# Altium schematic sheet MODULE_MD.SchDoc: MODULE MAIN DOMAIN
size A3; Author: Silvio Navaretti; CompanyName: ARDUINO; DrawnBy: Silvio Navaretti; Engineer: Silvio Navaretti; Organization: ARDUINO; SheetNumber: 3; SheetTotal: 51; RevAuthor: Silvio Navaretti
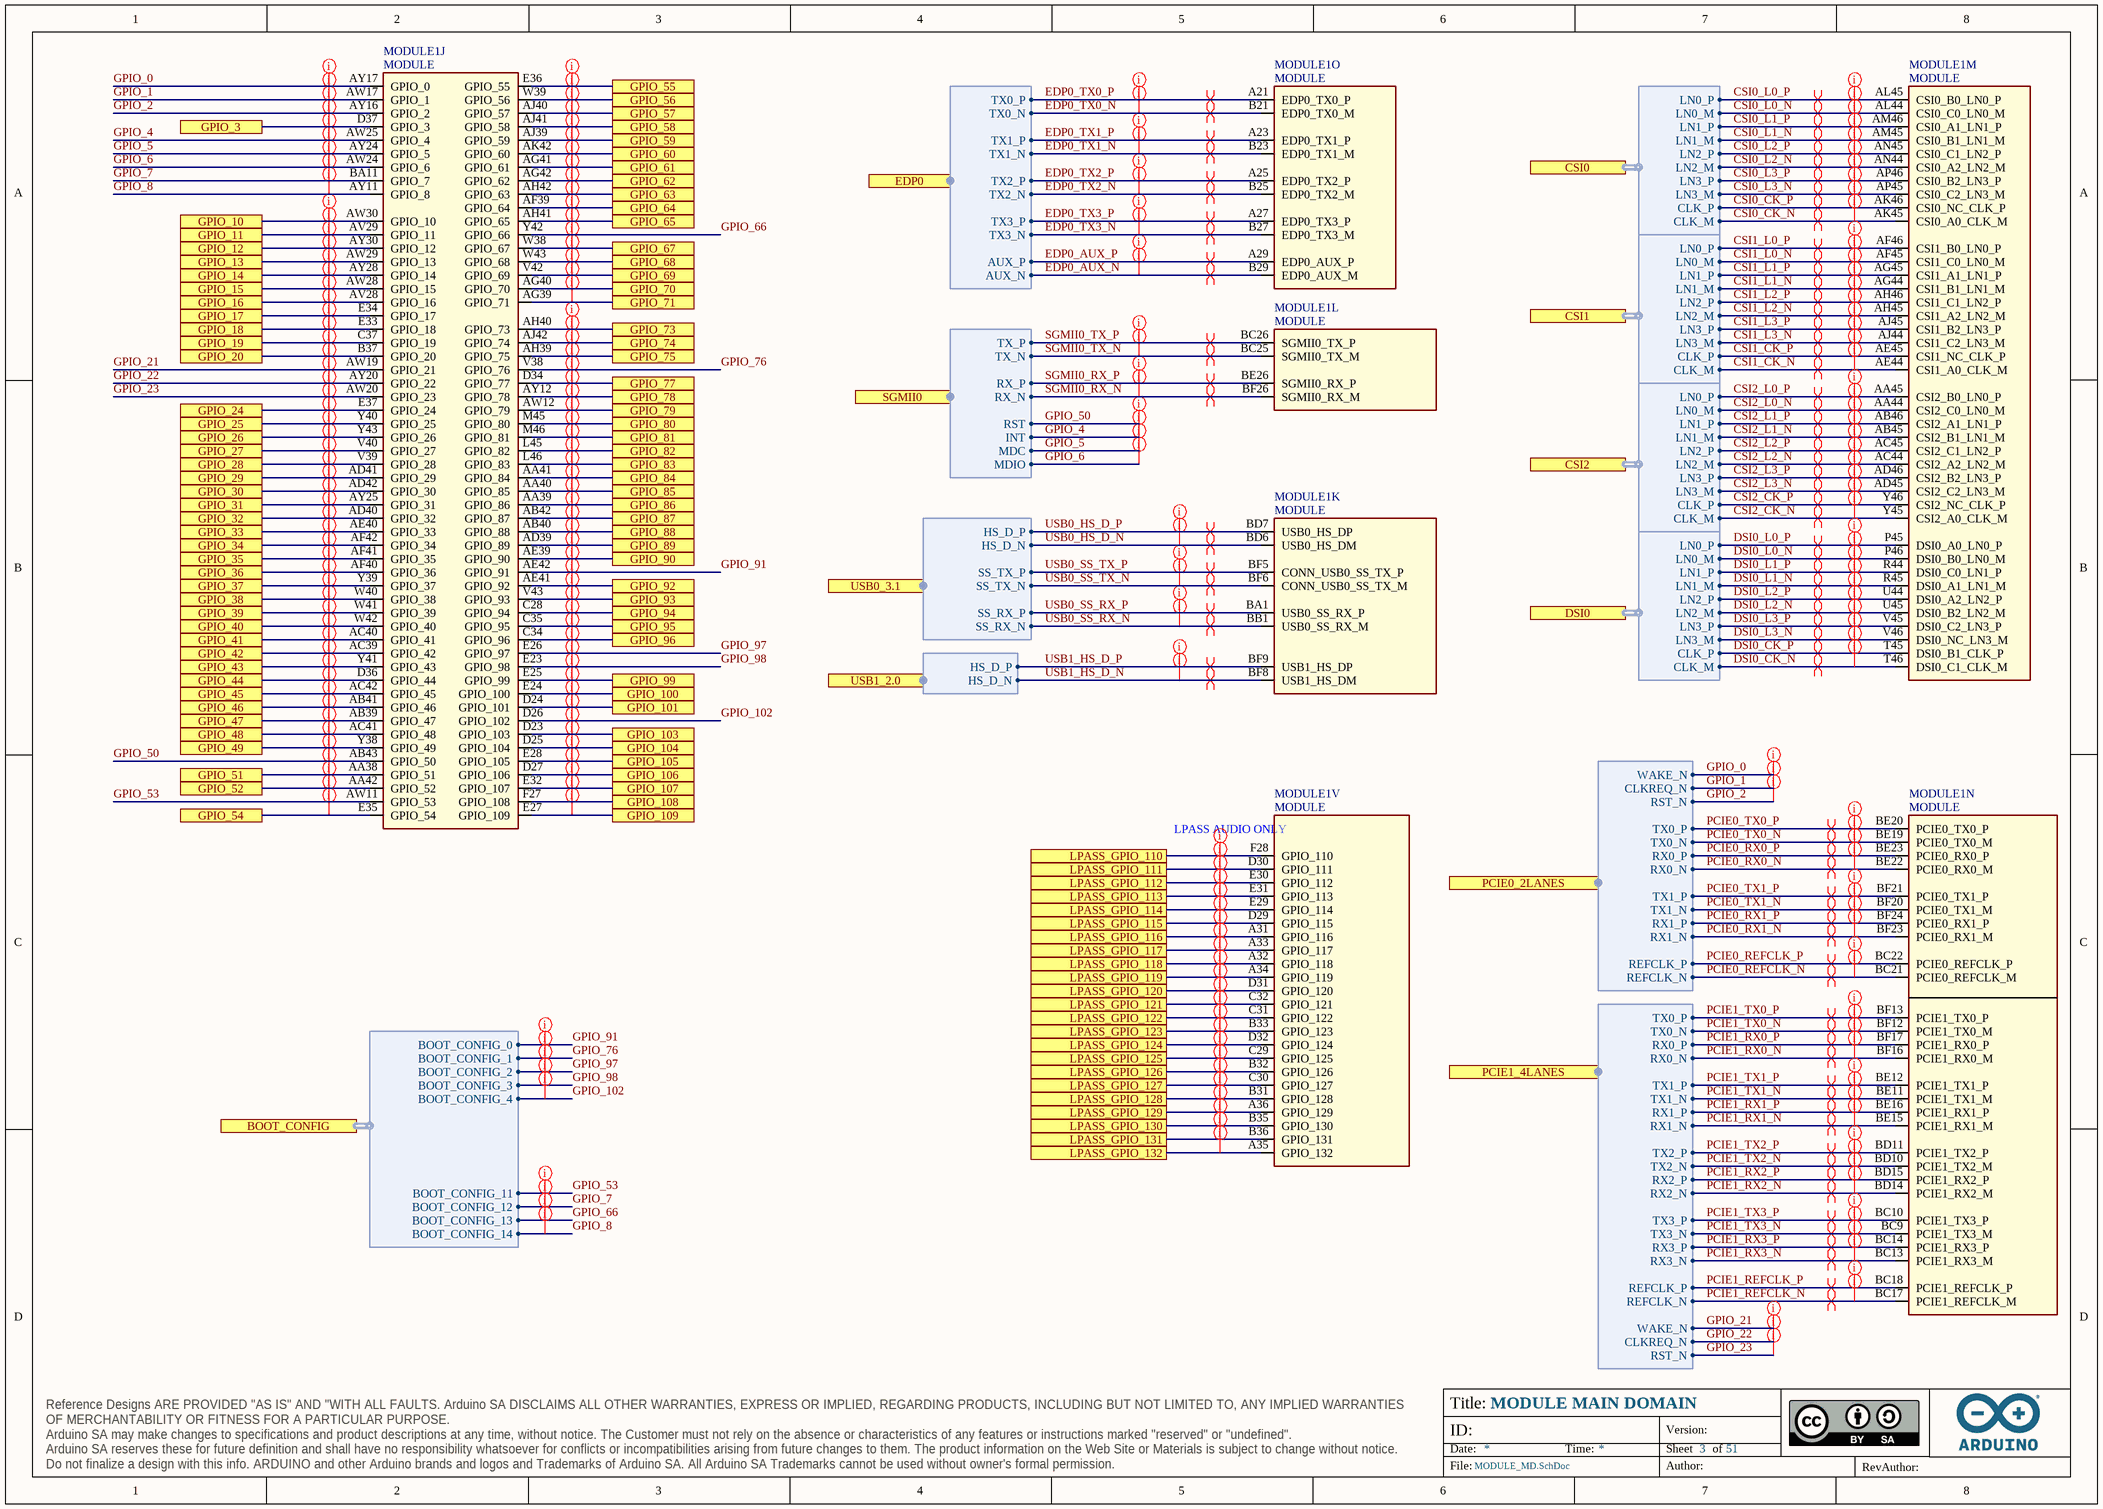
[diagram p0: MODULE_MD.SchDoc]

## Parts
MODULE1  MODULE  [MODULE]  (parts J,K,L,M,N,O,V of 22)

## Ports
BOOT_CONFIG (harness SOM_MD_BOOT_CONFIG), CSI0 (harness MIPI_4LANES), CSI1 (harness MIPI_4LANES), CSI2 (harness MIPI_4LANES), DSI0 (harness MIPI_4LANES), EDP0 (harness SOM_MD_EDP0), GPIO_3, GPIO_10, GPIO_11, GPIO_12, GPIO_13, GPIO_14, GPIO_15, GPIO_16, GPIO_17, GPIO_18, GPIO_19, GPIO_20, GPIO_24, GPIO_25, GPIO_26, GPIO_27, GPIO_28, GPIO_29, GPIO_30, GPIO_31, GPIO_32, GPIO_33, GPIO_34, GPIO_35, GPIO_36, GPIO_37, GPIO_38, GPIO_39, GPIO_40, GPIO_41, GPIO_42, GPIO_43, GPIO_44, GPIO_45, GPIO_46, GPIO_47, GPIO_48, GPIO_49, GPIO_51, GPIO_52, GPIO_54, GPIO_55, GPIO_56, GPIO_57, GPIO_58, GPIO_59, GPIO_60, GPIO_61, GPIO_62, GPIO_63, GPIO_64, GPIO_65, GPIO_67, GPIO_68, GPIO_69, GPIO_70, GPIO_71, GPIO_73, GPIO_74, GPIO_75, GPIO_77, GPIO_78, GPIO_79, GPIO_80, GPIO_81, GPIO_82, GPIO_83, GPIO_84, GPIO_85, GPIO_86, GPIO_87, GPIO_88, GPIO_89, GPIO_90, GPIO_92, GPIO_93, GPIO_94, GPIO_95, GPIO_96, GPIO_99, GPIO_100, GPIO_101, GPIO_103, GPIO_104, GPIO_105, GPIO_106, GPIO_107, GPIO_108, GPIO_109, LPASS_GPIO_110, LPASS_GPIO_111, LPASS_GPIO_112, LPASS_GPIO_113, LPASS_GPIO_114, LPASS_GPIO_115, LPASS_GPIO_116, LPASS_GPIO_117, LPASS_GPIO_118, LPASS_GPIO_119, LPASS_GPIO_120, LPASS_GPIO_121, LPASS_GPIO_122, LPASS_GPIO_123, LPASS_GPIO_124, LPASS_GPIO_125, LPASS_GPIO_126, LPASS_GPIO_127, LPASS_GPIO_128, LPASS_GPIO_129, LPASS_GPIO_130, LPASS_GPIO_131, LPASS_GPIO_132, PCIE0_2LANES (harness SOM_MD_PCIE0), PCIE1_4LANES (harness SOM_MD_PCIE1), SGMII0 (harness SOM_MD_SGMII0), USB0_3.1 (harness SOM_MD_USB0), USB1_2.0 (harness SOM_MD_USB1)

## Harnesses
MIPI_4LANES: LN3_M, LN2_M, LN2_P, LN0_M, LN0_P, CLK_M, CLK_P, LN1_M, LN1_P, LN3_P
SOM_MD_SGMII0: RX_P, RX_N, TX_P, TX_N, RST, MDC, INT, MDIO
SOM_MD_EDP0: TX0_P, TX1_P, TX2_P, TX3_P, AUX_P, TX0_N, TX1_N, TX2_N, TX3_N, AUX_N
SOM_MD_USB0: SS_TX_N, SS_TX_P, HS_D_P, HS_D_N, SS_RX_P, SS_RX_N
SOM_MD_USB1: HS_D_P, HS_D_N
SOM_MD_PCIE0: RX0_N, RX0_P, TX0_P, TX0_N, RX1_N, RX1_P, TX1_P, TX1_N, REFCLK_N, REFCLK_P, WAKE_N, CLKREQ_N, RST_N
SOM_MD_PCIE1: RX0_N, RX0_P, TX0_P, TX0_N, RX1_N, RX1_P, TX1_P, TX1_N, REFCLK_N, REFCLK_P, RX2_N, RX2_P, TX2_P, TX2_N, RX3_N, RX3_P, TX3_P, TX3_N, WAKE_N, CLKREQ_N, RST_N
SOM_MD_BOOT_CONFIG: BOOT_CONFIG_0, BOOT_CONFIG_1, BOOT_CONFIG_2, BOOT_CONFIG_3, BOOT_CONFIG_4, BOOT_CONFIG_11, BOOT_CONFIG_12, BOOT_CONFIG_13, BOOT_CONFIG_14

## Nets
CSI0_CK_N: MODULE1.AK45(CSI0_A0_CLK_M) ; port CSI0.CLK_M
CSI0_CK_P: MODULE1.AK46(CSI0_NC_CLK_P) ; port CSI0.CLK_P
CSI0_L0_N: MODULE1.AL44(CSI0_C0_LN0_M) ; port CSI0.LN0_M
CSI0_L0_P: MODULE1.AL45(CSI0_B0_LN0_P) ; port CSI0.LN0_P
CSI0_L1_N: MODULE1.AM45(CSI0_B1_LN1_M) ; port CSI0.LN1_M
CSI0_L1_P: MODULE1.AM46(CSI0_A1_LN1_P) ; port CSI0.LN1_P
CSI0_L2_N: MODULE1.AN44(CSI0_A2_LN2_M) ; port CSI0.LN2_M
CSI0_L2_P: MODULE1.AN45(CSI0_C1_LN2_P) ; port CSI0.LN2_P
CSI0_L3_N: MODULE1.AP45(CSI0_C2_LN3_M) ; port CSI0.LN3_M
CSI0_L3_P: MODULE1.AP46(CSI0_B2_LN3_P) ; port CSI0.LN3_P
CSI1_CK_N: MODULE1.AE44(CSI1_A0_CLK_M) ; port CSI1.CLK_M
CSI1_CK_P: MODULE1.AE45(CSI1_NC_CLK_P) ; port CSI1.CLK_P
CSI1_L0_N: MODULE1.AF45(CSI1_C0_LN0_M) ; port CSI1.LN0_M
CSI1_L0_P: MODULE1.AF46(CSI1_B0_LN0_P) ; port CSI1.LN0_P
CSI1_L1_N: MODULE1.AG44(CSI1_B1_LN1_M) ; port CSI1.LN1_M
CSI1_L1_P: MODULE1.AG45(CSI1_A1_LN1_P) ; port CSI1.LN1_P
CSI1_L2_N: MODULE1.AH45(CSI1_A2_LN2_M) ; port CSI1.LN2_M
CSI1_L2_P: MODULE1.AH46(CSI1_C1_LN2_P) ; port CSI1.LN2_P
CSI1_L3_N: MODULE1.AJ44(CSI1_C2_LN3_M) ; port CSI1.LN3_M
CSI1_L3_P: MODULE1.AJ45(CSI1_B2_LN3_P) ; port CSI1.LN3_P
CSI2_CK_N: MODULE1.Y45(CSI2_A0_CLK_M) ; port CSI2.CLK_M
CSI2_CK_P: MODULE1.Y46(CSI2_NC_CLK_P) ; port CSI2.CLK_P
CSI2_L0_N: MODULE1.AA44(CSI2_C0_LN0_M) ; port CSI2.LN0_M
CSI2_L0_P: MODULE1.AA45(CSI2_B0_LN0_P) ; port CSI2.LN0_P
CSI2_L1_N: MODULE1.AB45(CSI2_B1_LN1_M) ; port CSI2.LN1_M
CSI2_L1_P: MODULE1.AB46(CSI2_A1_LN1_P) ; port CSI2.LN1_P
CSI2_L2_N: MODULE1.AC44(CSI2_A2_LN2_M) ; port CSI2.LN2_M
CSI2_L2_P: MODULE1.AC45(CSI2_C1_LN2_P) ; port CSI2.LN2_P
CSI2_L3_N: MODULE1.AD45(CSI2_C2_LN3_M) ; port CSI2.LN3_M
CSI2_L3_P: MODULE1.AD46(CSI2_B2_LN3_P) ; port CSI2.LN3_P
DSI0_CK_N: MODULE1.T46(DSI0_C1_CLK_M) ; port DSI0.CLK_M
DSI0_CK_P: MODULE1.T45(DSI0_B1_CLK_P) ; port DSI0.CLK_P
DSI0_L0_N: MODULE1.P46(DSI0_B0_LN0_M) ; port DSI0.LN0_M
DSI0_L0_P: MODULE1.P45(DSI0_A0_LN0_P) ; port DSI0.LN0_P
DSI0_L1_N: MODULE1.R45(DSI0_A1_LN1_M) ; port DSI0.LN1_M
DSI0_L1_P: MODULE1.R44(DSI0_C0_LN1_P) ; port DSI0.LN1_P
DSI0_L2_N: MODULE1.U45(DSI0_B2_LN2_M) ; port DSI0.LN2_M
DSI0_L2_P: MODULE1.U44(DSI0_A2_LN2_P) ; port DSI0.LN2_P
DSI0_L3_N: MODULE1.V46(DSI0_NC_LN3_M) ; port DSI0.LN3_M
DSI0_L3_P: MODULE1.V45(DSI0_C2_LN3_P) ; port DSI0.LN3_P
EDP0_AUX_N: MODULE1.B29(EDP0_AUX_M) ; port EDP0.AUX_N
EDP0_AUX_P: MODULE1.A29(EDP0_AUX_P) ; port EDP0.AUX_P
EDP0_TX0_N: MODULE1.B21(EDP0_TX0_M) ; port EDP0.TX0_N
EDP0_TX0_P: MODULE1.A21(EDP0_TX0_P) ; port EDP0.TX0_P
EDP0_TX1_N: MODULE1.B23(EDP0_TX1_M) ; port EDP0.TX1_N
EDP0_TX1_P: MODULE1.A23(EDP0_TX1_P) ; port EDP0.TX1_P
EDP0_TX2_N: MODULE1.B25(EDP0_TX2_M) ; port EDP0.TX2_N
EDP0_TX2_P: MODULE1.A25(EDP0_TX2_P) ; port EDP0.TX2_P
EDP0_TX3_N: MODULE1.B27(EDP0_TX3_M) ; port EDP0.TX3_N
EDP0_TX3_P: MODULE1.A27(EDP0_TX3_P) ; port EDP0.TX3_P
GPIO_0: MODULE1.AY17(GPIO_0) ; port PCIE0_2LANES.WAKE_N
GPIO_1: MODULE1.AW17(GPIO_1) ; port PCIE0_2LANES.CLKREQ_N
GPIO_2: MODULE1.AY16(GPIO_2) ; port PCIE0_2LANES.RST_N
GPIO_3: MODULE1.D37(GPIO_3) ; port GPIO_3
GPIO_4: MODULE1.AW25(GPIO_4) ; port SGMII0.INT
GPIO_5: MODULE1.AY24(GPIO_5) ; port SGMII0.MDC
GPIO_6: MODULE1.AW24(GPIO_6) ; port SGMII0.MDIO
GPIO_7: MODULE1.BA11(GPIO_7) ; port BOOT_CONFIG.BOOT_CONFIG_12
GPIO_8: MODULE1.AY11(GPIO_8) ; port BOOT_CONFIG.BOOT_CONFIG_14
GPIO_10: MODULE1.AW30(GPIO_10) ; port GPIO_10
GPIO_11: MODULE1.AV29(GPIO_11) ; port GPIO_11
GPIO_12: MODULE1.AY30(GPIO_12) ; port GPIO_12
GPIO_13: MODULE1.AW29(GPIO_13) ; port GPIO_13
GPIO_14: MODULE1.AY28(GPIO_14) ; port GPIO_14
GPIO_15: MODULE1.AW28(GPIO_15) ; port GPIO_15
GPIO_16: MODULE1.AV28(GPIO_16) ; port GPIO_16
GPIO_17: MODULE1.E34(GPIO_17) ; port GPIO_17
GPIO_18: MODULE1.E33(GPIO_18) ; port GPIO_18
GPIO_19: MODULE1.C37(GPIO_19) ; port GPIO_19
GPIO_20: MODULE1.B37(GPIO_20) ; port GPIO_20
GPIO_21: MODULE1.AW19(GPIO_21) ; port PCIE1_4LANES.WAKE_N
GPIO_22: MODULE1.AY20(GPIO_22) ; port PCIE1_4LANES.CLKREQ_N
GPIO_23: MODULE1.AW20(GPIO_23) ; port PCIE1_4LANES.RST_N
GPIO_24: MODULE1.E37(GPIO_24) ; port GPIO_24
GPIO_25: MODULE1.Y40(GPIO_25) ; port GPIO_25
GPIO_26: MODULE1.Y43(GPIO_26) ; port GPIO_26
GPIO_27: MODULE1.V40(GPIO_27) ; port GPIO_27
GPIO_28: MODULE1.V39(GPIO_28) ; port GPIO_28
GPIO_29: MODULE1.AD41(GPIO_29) ; port GPIO_29
GPIO_30: MODULE1.AD42(GPIO_30) ; port GPIO_30
GPIO_31: MODULE1.AY25(GPIO_31) ; port GPIO_31
GPIO_32: MODULE1.AD40(GPIO_32) ; port GPIO_32
GPIO_33: MODULE1.AE40(GPIO_33) ; port GPIO_33
GPIO_34: MODULE1.AF42(GPIO_34) ; port GPIO_34
GPIO_35: MODULE1.AF41(GPIO_35) ; port GPIO_35
GPIO_36: MODULE1.AF40(GPIO_36) ; port GPIO_36
GPIO_37: MODULE1.Y39(GPIO_37) ; port GPIO_37
GPIO_38: MODULE1.W40(GPIO_38) ; port GPIO_38
GPIO_39: MODULE1.W41(GPIO_39) ; port GPIO_39
GPIO_40: MODULE1.W42(GPIO_40) ; port GPIO_40
GPIO_41: MODULE1.AC40(GPIO_41) ; port GPIO_41
GPIO_42: MODULE1.AC39(GPIO_42) ; port GPIO_42
GPIO_43: MODULE1.Y41(GPIO_43) ; port GPIO_43
GPIO_44: MODULE1.D36(GPIO_44) ; port GPIO_44
GPIO_45: MODULE1.AC42(GPIO_45) ; port GPIO_45
GPIO_46: MODULE1.AB41(GPIO_46) ; port GPIO_46
GPIO_47: MODULE1.AB39(GPIO_47) ; port GPIO_47
GPIO_48: MODULE1.AC41(GPIO_48) ; port GPIO_48
GPIO_49: MODULE1.Y38(GPIO_49) ; port GPIO_49
GPIO_50: MODULE1.AB43(GPIO_50) ; port SGMII0.RST
GPIO_51: MODULE1.AA38(GPIO_51) ; port GPIO_51
GPIO_52: MODULE1.AA42(GPIO_52) ; port GPIO_52
GPIO_53: MODULE1.AW11(GPIO_53) ; port BOOT_CONFIG.BOOT_CONFIG_11
GPIO_54: MODULE1.E35(GPIO_54) ; port GPIO_54
GPIO_55: MODULE1.E36(GPIO_55) ; port GPIO_55
GPIO_56: MODULE1.W39(GPIO_56) ; port GPIO_56
GPIO_57: MODULE1.AJ40(GPIO_57) ; port GPIO_57
GPIO_58: MODULE1.AJ41(GPIO_58) ; port GPIO_58
GPIO_59: MODULE1.AJ39(GPIO_59) ; port GPIO_59
GPIO_60: MODULE1.AK42(GPIO_60) ; port GPIO_60
GPIO_61: MODULE1.AG41(GPIO_61) ; port GPIO_61
GPIO_62: MODULE1.AG42(GPIO_62) ; port GPIO_62
GPIO_63: MODULE1.AH42(GPIO_63) ; port GPIO_63
GPIO_64: MODULE1.AF39(GPIO_64) ; port GPIO_64
GPIO_65: MODULE1.AH41(GPIO_65) ; port GPIO_65
GPIO_66: MODULE1.Y42(GPIO_66) ; port BOOT_CONFIG.BOOT_CONFIG_13
GPIO_67: MODULE1.W38(GPIO_67) ; port GPIO_67
GPIO_68: MODULE1.W43(GPIO_68) ; port GPIO_68
GPIO_69: MODULE1.V42(GPIO_69) ; port GPIO_69
GPIO_70: MODULE1.AG40(GPIO_70) ; port GPIO_70
GPIO_71: MODULE1.AG39(GPIO_71) ; port GPIO_71
GPIO_73: MODULE1.AH40(GPIO_73) ; port GPIO_73
GPIO_74: MODULE1.AJ42(GPIO_74) ; port GPIO_74
GPIO_75: MODULE1.AH39(GPIO_75) ; port GPIO_75
GPIO_76: MODULE1.V38(GPIO_76) ; port BOOT_CONFIG.BOOT_CONFIG_1
GPIO_77: MODULE1.D34(GPIO_77) ; port GPIO_77
GPIO_78: MODULE1.AY12(GPIO_78) ; port GPIO_78
GPIO_79: MODULE1.AW12(GPIO_79) ; port GPIO_79
GPIO_80: MODULE1.M45(GPIO_80) ; port GPIO_80
GPIO_81: MODULE1.M46(GPIO_81) ; port GPIO_81
GPIO_82: MODULE1.L45(GPIO_82) ; port GPIO_82
GPIO_83: MODULE1.L46(GPIO_83) ; port GPIO_83
GPIO_84: MODULE1.AA41(GPIO_84) ; port GPIO_84
GPIO_85: MODULE1.AA40(GPIO_85) ; port GPIO_85
GPIO_86: MODULE1.AA39(GPIO_86) ; port GPIO_86
GPIO_87: MODULE1.AB42(GPIO_87) ; port GPIO_87
GPIO_88: MODULE1.AB40(GPIO_88) ; port GPIO_88
GPIO_89: MODULE1.AD39(GPIO_89) ; port GPIO_89
GPIO_90: MODULE1.AE39(GPIO_90) ; port GPIO_90
GPIO_91: MODULE1.AE42(GPIO_91) ; port BOOT_CONFIG.BOOT_CONFIG_0
GPIO_92: MODULE1.AE41(GPIO_92) ; port GPIO_92
GPIO_93: MODULE1.V43(GPIO_93) ; port GPIO_93
GPIO_94: MODULE1.C28(GPIO_94) ; port GPIO_94
GPIO_95: MODULE1.C35(GPIO_95) ; port GPIO_95
GPIO_96: MODULE1.C34(GPIO_96) ; port GPIO_96
GPIO_97: MODULE1.E26(GPIO_97) ; port BOOT_CONFIG.BOOT_CONFIG_2
GPIO_98: MODULE1.E23(GPIO_98) ; port BOOT_CONFIG.BOOT_CONFIG_3
GPIO_99: MODULE1.E25(GPIO_99) ; port GPIO_99
GPIO_100: MODULE1.E24(GPIO_100) ; port GPIO_100
GPIO_101: MODULE1.D24(GPIO_101) ; port GPIO_101
GPIO_102: MODULE1.D26(GPIO_102) ; port BOOT_CONFIG.BOOT_CONFIG_4
GPIO_103: MODULE1.D23(GPIO_103) ; port GPIO_103
GPIO_104: MODULE1.D25(GPIO_104) ; port GPIO_104
GPIO_105: MODULE1.E28(GPIO_105) ; port GPIO_105
GPIO_106: MODULE1.D27(GPIO_106) ; port GPIO_106
GPIO_107: MODULE1.E32(GPIO_107) ; port GPIO_107
GPIO_108: MODULE1.F27(GPIO_108) ; port GPIO_108
GPIO_109: MODULE1.E27(GPIO_109) ; port GPIO_109
LPASS_GPIO_110: MODULE1.F28(GPIO_110) ; port LPASS_GPIO_110
LPASS_GPIO_111: MODULE1.D30(GPIO_111) ; port LPASS_GPIO_111
LPASS_GPIO_112: MODULE1.E30(GPIO_112) ; port LPASS_GPIO_112
LPASS_GPIO_113: MODULE1.E31(GPIO_113) ; port LPASS_GPIO_113
LPASS_GPIO_114: MODULE1.E29(GPIO_114) ; port LPASS_GPIO_114
LPASS_GPIO_115: MODULE1.D29(GPIO_115) ; port LPASS_GPIO_115
LPASS_GPIO_116: MODULE1.A31(GPIO_116) ; port LPASS_GPIO_116
LPASS_GPIO_117: MODULE1.A33(GPIO_117) ; port LPASS_GPIO_117
LPASS_GPIO_118: MODULE1.A32(GPIO_118) ; port LPASS_GPIO_118
LPASS_GPIO_119: MODULE1.A34(GPIO_119) ; port LPASS_GPIO_119
LPASS_GPIO_120: MODULE1.D31(GPIO_120) ; port LPASS_GPIO_120
LPASS_GPIO_121: MODULE1.C32(GPIO_121) ; port LPASS_GPIO_121
LPASS_GPIO_122: MODULE1.C31(GPIO_122) ; port LPASS_GPIO_122
LPASS_GPIO_123: MODULE1.B33(GPIO_123) ; port LPASS_GPIO_123
LPASS_GPIO_124: MODULE1.D32(GPIO_124) ; port LPASS_GPIO_124
LPASS_GPIO_125: MODULE1.C29(GPIO_125) ; port LPASS_GPIO_125
LPASS_GPIO_126: MODULE1.B32(GPIO_126) ; port LPASS_GPIO_126
LPASS_GPIO_127: MODULE1.C30(GPIO_127) ; port LPASS_GPIO_127
LPASS_GPIO_128: MODULE1.B31(GPIO_128) ; port LPASS_GPIO_128
LPASS_GPIO_129: MODULE1.A36(GPIO_129) ; port LPASS_GPIO_129
LPASS_GPIO_130: MODULE1.B35(GPIO_130) ; port LPASS_GPIO_130
LPASS_GPIO_131: MODULE1.B36(GPIO_131) ; port LPASS_GPIO_131
LPASS_GPIO_132: MODULE1.A35(GPIO_132) ; port LPASS_GPIO_132
PCIE0_REFCLK_N: MODULE1.BC21(PCIE0_REFCLK_M) ; port PCIE0_2LANES.REFCLK_N
PCIE0_REFCLK_P: MODULE1.BC22(PCIE0_REFCLK_P) ; port PCIE0_2LANES.REFCLK_P
PCIE0_RX0_N: MODULE1.BE22(PCIE0_RX0_M) ; port PCIE0_2LANES.RX0_N
PCIE0_RX0_P: MODULE1.BE23(PCIE0_RX0_P) ; port PCIE0_2LANES.RX0_P
PCIE0_RX1_N: MODULE1.BF23(PCIE0_RX1_M) ; port PCIE0_2LANES.RX1_N
PCIE0_RX1_P: MODULE1.BF24(PCIE0_RX1_P) ; port PCIE0_2LANES.RX1_P
PCIE0_TX0_N: MODULE1.BE19(PCIE0_TX0_M) ; port PCIE0_2LANES.TX0_N
PCIE0_TX0_P: MODULE1.BE20(PCIE0_TX0_P) ; port PCIE0_2LANES.TX0_P
PCIE0_TX1_N: MODULE1.BF20(PCIE0_TX1_M) ; port PCIE0_2LANES.TX1_N
PCIE0_TX1_P: MODULE1.BF21(PCIE0_TX1_P) ; port PCIE0_2LANES.TX1_P
PCIE1_REFCLK_N: MODULE1.BC17(PCIE1_REFCLK_M) ; port PCIE1_4LANES.REFCLK_N
PCIE1_REFCLK_P: MODULE1.BC18(PCIE1_REFCLK_P) ; port PCIE1_4LANES.REFCLK_P
PCIE1_RX0_N: MODULE1.BF16(PCIE1_RX0_M) ; port PCIE1_4LANES.RX0_N
PCIE1_RX0_P: MODULE1.BF17(PCIE1_RX0_P) ; port PCIE1_4LANES.RX0_P
PCIE1_RX1_N: MODULE1.BE15(PCIE1_RX1_M) ; port PCIE1_4LANES.RX1_N
PCIE1_RX1_P: MODULE1.BE16(PCIE1_RX1_P) ; port PCIE1_4LANES.RX1_P
PCIE1_RX2_N: MODULE1.BD14(PCIE1_RX2_M) ; port PCIE1_4LANES.RX2_N
PCIE1_RX2_P: MODULE1.BD15(PCIE1_RX2_P) ; port PCIE1_4LANES.RX2_P
PCIE1_RX3_N: MODULE1.BC13(PCIE1_RX3_M) ; port PCIE1_4LANES.RX3_N
PCIE1_RX3_P: MODULE1.BC14(PCIE1_RX3_P) ; port PCIE1_4LANES.RX3_P
PCIE1_TX0_N: MODULE1.BF12(PCIE1_TX0_M) ; port PCIE1_4LANES.TX0_N
PCIE1_TX0_P: MODULE1.BF13(PCIE1_TX0_P) ; port PCIE1_4LANES.TX0_P
PCIE1_TX1_N: MODULE1.BE11(PCIE1_TX1_M) ; port PCIE1_4LANES.TX1_N
PCIE1_TX1_P: MODULE1.BE12(PCIE1_TX1_P) ; port PCIE1_4LANES.TX1_P
PCIE1_TX2_N: MODULE1.BD10(PCIE1_TX2_M) ; port PCIE1_4LANES.TX2_N
PCIE1_TX2_P: MODULE1.BD11(PCIE1_TX2_P) ; port PCIE1_4LANES.TX2_P
PCIE1_TX3_N: MODULE1.BC9(PCIE1_TX3_M) ; port PCIE1_4LANES.TX3_N
PCIE1_TX3_P: MODULE1.BC10(PCIE1_TX3_P) ; port PCIE1_4LANES.TX3_P
SGMII0_RX_N: MODULE1.BF26(SGMII0_RX_M) ; port SGMII0.RX_N
SGMII0_RX_P: MODULE1.BE26(SGMII0_RX_P) ; port SGMII0.RX_P
SGMII0_TX_N: MODULE1.BC25(SGMII0_TX_M) ; port SGMII0.TX_N
SGMII0_TX_P: MODULE1.BC26(SGMII0_TX_P) ; port SGMII0.TX_P
USB0_HS_D_N: MODULE1.BD6(USB0_HS_DM) ; port USB0_3.1.HS_D_N
USB0_HS_D_P: MODULE1.BD7(USB0_HS_DP) ; port USB0_3.1.HS_D_P
USB0_SS_RX_N: MODULE1.BB1(USB0_SS_RX_M) ; port USB0_3.1.SS_RX_N
USB0_SS_RX_P: MODULE1.BA1(USB0_SS_RX_P) ; port USB0_3.1.SS_RX_P
USB0_SS_TX_N: MODULE1.BF6(CONN_USB0_SS_TX_M) ; port USB0_3.1.SS_TX_N
USB0_SS_TX_P: MODULE1.BF5(CONN_USB0_SS_TX_P) ; port USB0_3.1.SS_TX_P
USB1_HS_D_N: MODULE1.BF8(USB1_HS_DM) ; port USB1_2.0.HS_D_N
USB1_HS_D_P: MODULE1.BF9(USB1_HS_DP) ; port USB1_2.0.HS_D_P

## Layout directives
differential pair; differential pair class DIFF_MD_CSI0; net class NET_DIFF_CSI_DSI: CSI0_CK_N, CSI0_CK_P, CSI0_L0_N, CSI0_L0_P, CSI0_L1_N, CSI0_L1_P, CSI0_L2_N, CSI0_L2_P, CSI0_L3_N, CSI0_L3_P
differential pair; differential pair class DIFF_MD_CSI1; net class NET_DIFF_CSI_DSI: CSI1_CK_N, CSI1_CK_P, CSI1_L0_N, CSI1_L0_P, CSI1_L1_N, CSI1_L1_P, CSI1_L2_N, CSI1_L2_P, CSI1_L3_N, CSI1_L3_P
differential pair; differential pair class DIFF_MD_CSI2; net class NET_DIFF_CSI_DSI: CSI2_CK_N, CSI2_CK_P, CSI2_L0_N, CSI2_L0_P, CSI2_L1_N, CSI2_L1_P, CSI2_L2_N, CSI2_L2_P, CSI2_L3_N, CSI2_L3_P
differential pair; differential pair class DIFF_MD_DSI0; net class NET_DIFF_CSI_DSI: DSI0_CK_N, DSI0_CK_P, DSI0_L0_N, DSI0_L0_P, DSI0_L1_N, DSI0_L1_P, DSI0_L2_N, DSI0_L2_P, DSI0_L3_N, DSI0_L3_P
differential pair; differential pair class DIFF_MD_EDP; net class NET_DIFF_MD: EDP0_AUX_N, EDP0_AUX_P, EDP0_TX0_N, EDP0_TX0_P, EDP0_TX1_N, EDP0_TX1_P, EDP0_TX2_N, EDP0_TX2_P, EDP0_TX3_N, EDP0_TX3_P
differential pair; differential pair class DIFF_MD_SGMII; net class NET_DIFF_SGMII: SGMII0_RX_N, SGMII0_RX_P, SGMII0_TX_N, SGMII0_TX_P
differential pair; differential pair class DIFF_MD_USB0; net class DIFF_USB: USB0_HS_D_N, USB0_HS_D_P, USB0_SS_RX_N, USB0_SS_RX_P, USB0_SS_TX_N, USB0_SS_TX_P
differential pair; differential pair class DIFF_MD_PCIE0; net class NET_DIFF_PCIE: PCIE0_REFCLK_N, PCIE0_REFCLK_P, PCIE0_RX0_N, PCIE0_RX0_P, PCIE0_RX1_N, PCIE0_RX1_P, PCIE0_TX0_N, PCIE0_TX0_P, PCIE0_TX1_N, PCIE0_TX1_P
differential pair; differential pair class DIFF_MD_PCIE1; net class NET_DIFF_PCIE: PCIE1_REFCLK_N, PCIE1_REFCLK_P, PCIE1_RX0_N, PCIE1_RX0_P, PCIE1_RX1_N, PCIE1_RX1_P, PCIE1_RX2_N, PCIE1_RX2_P, PCIE1_RX3_N, PCIE1_RX3_P, PCIE1_TX0_N, PCIE1_TX0_P, PCIE1_TX1_N, PCIE1_TX1_P, PCIE1_TX2_N, PCIE1_TX2_P, PCIE1_TX3_N, PCIE1_TX3_P
net class NET_SOM_MD_SGMII0: GPIO_4, GPIO_5, GPIO_6, GPIO_50, SGMII0_RX_N, SGMII0_RX_P, SGMII0_TX_N, SGMII0_TX_P
net class NET_SOM_MD_USB0: USB0_HS_D_N, USB0_HS_D_P, USB0_SS_RX_N, USB0_SS_RX_P, USB0_SS_TX_N, USB0_SS_TX_P
net class NET_SOM_MD_USB1: USB1_HS_D_N, USB1_HS_D_P
differential pair; differential pair class DIFF_MD_USB1; net class DIFF_USB: USB1_HS_D_N, USB1_HS_D_P
net class NET_SOM_MD_GPIO: GPIO_0, GPIO_1, GPIO_2, GPIO_3, GPIO_4, GPIO_5, GPIO_6, GPIO_7, GPIO_8, GPIO_10, GPIO_11, GPIO_12, GPIO_13, GPIO_14, GPIO_15, GPIO_16, GPIO_17, GPIO_18, GPIO_19, GPIO_20, GPIO_21, GPIO_22, GPIO_23, GPIO_24, GPIO_25, GPIO_26, GPIO_27, GPIO_28, GPIO_29, GPIO_30, GPIO_31, GPIO_32, GPIO_33, GPIO_34, GPIO_35, GPIO_36, GPIO_37, GPIO_38, GPIO_39, GPIO_40, GPIO_41, GPIO_42, GPIO_43, GPIO_44, GPIO_45, GPIO_46, GPIO_47, GPIO_48, GPIO_49, GPIO_50, GPIO_51, GPIO_52, GPIO_53, GPIO_54, GPIO_55, GPIO_56, GPIO_57, GPIO_58, GPIO_59, GPIO_60, GPIO_61, GPIO_62, GPIO_63, GPIO_64, GPIO_65, GPIO_66, GPIO_67, GPIO_68, GPIO_69, GPIO_70, GPIO_71, GPIO_73, GPIO_74, GPIO_75, GPIO_76, GPIO_77, GPIO_78, GPIO_79, GPIO_80, GPIO_81, GPIO_82, GPIO_83, GPIO_84, GPIO_85, GPIO_86, GPIO_87, GPIO_88, GPIO_89, GPIO_90, GPIO_91, GPIO_92, GPIO_93, GPIO_94, GPIO_95, GPIO_96, GPIO_97, GPIO_98, GPIO_99, GPIO_100, GPIO_101, GPIO_102, GPIO_103, GPIO_104, GPIO_105, GPIO_106, GPIO_107, GPIO_108, GPIO_109
net class NET_SOM_MD_EDP0: EDP0_AUX_N, EDP0_AUX_P, EDP0_TX0_N, EDP0_TX0_P, EDP0_TX1_N, EDP0_TX1_P, EDP0_TX2_N, EDP0_TX2_P, EDP0_TX3_N, EDP0_TX3_P
net class NET_SOM_MD_CSI0: CSI0_CK_N, CSI0_CK_P, CSI0_L0_N, CSI0_L0_P, CSI0_L1_N, CSI0_L1_P, CSI0_L2_N, CSI0_L2_P, CSI0_L3_N, CSI0_L3_P
net class NET_SOM_MD_CSI1: CSI1_CK_N, CSI1_CK_P, CSI1_L0_N, CSI1_L0_P, CSI1_L1_N, CSI1_L1_P, CSI1_L2_N, CSI1_L2_P, CSI1_L3_N, CSI1_L3_P
net class NET_SOM_MD_CSI2: CSI2_CK_N, CSI2_CK_P, CSI2_L0_N, CSI2_L0_P, CSI2_L1_N, CSI2_L1_P, CSI2_L2_N, CSI2_L2_P, CSI2_L3_N, CSI2_L3_P
net class NET_SOM_MD_DSI0: DSI0_CK_N, DSI0_CK_P, DSI0_L0_N, DSI0_L0_P, DSI0_L1_N, DSI0_L1_P, DSI0_L2_N, DSI0_L2_P, DSI0_L3_N, DSI0_L3_P
net class NET_SOM_MD_PCIE0: GPIO_0, GPIO_1, GPIO_2, PCIE0_REFCLK_N, PCIE0_REFCLK_P, PCIE0_RX0_N, PCIE0_RX0_P, PCIE0_RX1_N, PCIE0_RX1_P, PCIE0_TX0_N, PCIE0_TX0_P, PCIE0_TX1_N, PCIE0_TX1_P
net class NET_SOM_MD_PCIE1: GPIO_21, GPIO_22, GPIO_23, PCIE1_REFCLK_N, PCIE1_REFCLK_P, PCIE1_RX0_N, PCIE1_RX0_P, PCIE1_RX1_N, PCIE1_RX1_P, PCIE1_RX2_N, PCIE1_RX2_P, PCIE1_RX3_N, PCIE1_RX3_P, PCIE1_TX0_N, PCIE1_TX0_P, PCIE1_TX1_N, PCIE1_TX1_P, PCIE1_TX2_N, PCIE1_TX2_P, PCIE1_TX3_N, PCIE1_TX3_P
net class NET_SOM_MD_GPIO; net class NET_SOM_MD_GPIO_LPASS: LPASS_GPIO_110, LPASS_GPIO_111, LPASS_GPIO_112, LPASS_GPIO_113, LPASS_GPIO_114, LPASS_GPIO_115, LPASS_GPIO_116, LPASS_GPIO_117, LPASS_GPIO_118, LPASS_GPIO_119, LPASS_GPIO_120, LPASS_GPIO_121, LPASS_GPIO_122, LPASS_GPIO_123, LPASS_GPIO_124, LPASS_GPIO_125, LPASS_GPIO_126, LPASS_GPIO_127, LPASS_GPIO_128, LPASS_GPIO_129, LPASS_GPIO_130, LPASS_GPIO_131, LPASS_GPIO_132
net class NET_SOM_MD_BOOT: GPIO_7, GPIO_8, GPIO_53, GPIO_66, GPIO_76, GPIO_91, GPIO_97, GPIO_98, GPIO_102

## Notes on the sheet
- Title:
- ID:
- Date:
- Time:
- Version:
- Sheet
- of
- RevAuthor:
- Reference Designs ARE PROVIDED "AS IS" AND "WITH ALL FAULTS. Arduino SA DISCLAIMS ALL OTHER WARRANTIES, EXPRESS OR IMPLIED, REGARDING PRODUCTS, INCLUDING BUT NOT LIMITED TO, ANY IMPLIED WARRANTIES OF MERCHANTABILITY OR FITNESS FOR A PARTICULAR PURPOSE.
  Arduino SA may make changes to specifications and product descriptions at any time, without notice. The Customer must not rely on the absence or characteristics of any features or instructions marked "reserved" or "undefined".
  Arduino SA reserves these for future definition and shall have no responsibility whatsoever for conflicts or incompatibilities arising from future changes to them. The product information on the Web Site or Materials is subject to change without notice.
  Do not finalize a design with this info. ARDUINO and other Arduino brands and logos and Trademarks of Arduino SA. All Arduino SA Trademarks cannot be used without owner's formal permission.
- File:
- Author:
- (in symbol M0029-A.19, part V) LPASS AUDIO ONLY

## Library data of the parts
MODULE1 = M0029-A.19: MODULE BGA 1883 balls 57.5x57.5mm; Manufacturer: Qualcomm; Code Arduino: M0029; Part Number: MODULE BGA; Pin Count: 1883